# Altium project ColdBlock_PID_Main01.PrjPcb
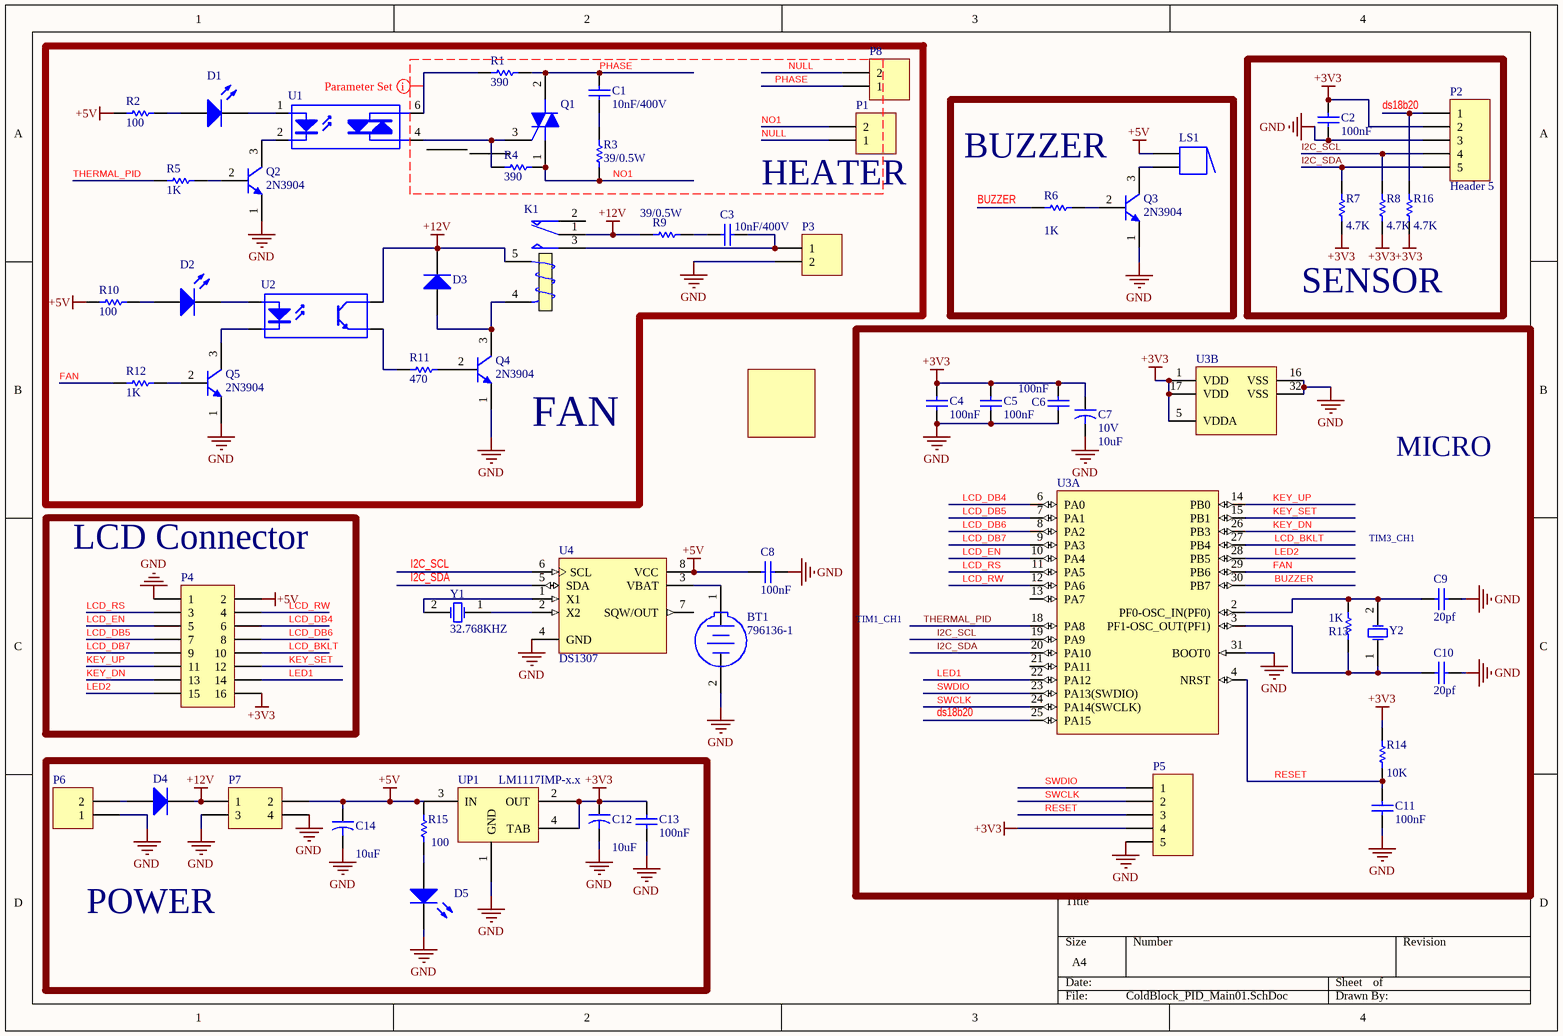
[diagram p0: ColdBlock_PID_Main01.SchDoc]
1 sheet, 59 parts. Net scope: global (net labels, ports and power ports of the same name join across sheets).
Board file: ColdBlock_PID_Main01.PcbDoc

## Sheet ColdBlock_PID_Main01.SchDoc
size A4

### Parts
*  Logo  [LOGO_PARS_TOP]  (value not drawn)
BT1  796136-1  [BTH2032_dip]
C1  10nF/400V  [Cap_polyester_400V]
C2  value 100nF  [CAP_MLCC_RAD_0.1]  (hidden comment: Cap)
C3  10nF/400V  [Cap_polyester_400V]
C4  value 100nF  [CAP_MLCC_RAD_0.1]  (hidden comment: Cap)
C5  value 100nF  [CAP_MLCC_RAD_0.1]  (hidden comment: Cap)
C6  value 100nF  [CAP_MLCC_RAD_0.1]  (hidden comment: Cap)
C7  10V  value 10uF  [Cap electrolitic radial 5x11-2]
C8  value 100nF  [CAP_MLCC_RAD_0.1]  (hidden comment: Cap)
C9  value 20pf  [CAP_MLCC_RAD_0.1]  (hidden comment: Cap)
C10  value 20pf  [CAP_MLCC_RAD_0.1]  (hidden comment: Cap)
C11  value 100nF  [CAP_MLCC_RAD_0.1]  (hidden comment: Cap)
C12  value 10uF  [Cap electrolitic radial 5x11-2]  (hidden comment: 16V)
C13  value 100nF  [CAP_MLCC_RAD_0.1]  (hidden comment: Cap)
C14  value 10uF  [Cap electrolitic radial 5x11-2]  (hidden comment: 25 V)
D1  LED1  [LED5MM_BLUE]  (value not drawn)
D2  LED1  [LED5MM_RED]  (value not drawn)
D3  Diode 1N4007  [do-204al]  (value not drawn)
D4  1N4007  [DO-204AL]  (value not drawn)
D5  LED0  [LED5MM_BLUE]  (value not drawn)
K1  Relay/12V  [Relay 18.85x15.35x15.70]  (value not drawn)
LS1  Buzzer  [BUZZER_12A05]  (value not drawn)
P1  Header 2  [KF301 2PIN]  (value not drawn)
P2  Header 5  [HDR1X5]
P3  Header 2  [KF301 2PIN]  (value not drawn)
P4  Header 8X2  [IDC2.54_16PIN]  (value not drawn)
P5  Header 5  [HDR_1x6]  (value not drawn)
P6  Header 2  [KF301 2PIN]  (value not drawn)
P7  MINI-360  [MINI360-DCDC]  (value not drawn)
P8  Header 2  [KF301 2PIN]  (value not drawn)
Q1  BT139  [TO-220 AB]  (value not drawn)
Q2  2N3904  [TO-92 STR]
Q3  2N3904  [TO-92 STR]
Q4  2N3904  [TO-92 STR]
Q5  2N3904  [TO-92 STR]
R1  value 390  [Axial 0_5W 5_0mm]  (hidden comment: Res1)
R2  value 100  [Axial 0_25 W, 0_4 IN LEAD PITCH]  (hidden comment: Res1)
R3  value 39/0.5W  [Axial 0_5W 5_0mm]  (hidden comment: Res1)
R4  value 390  [Axial 0_5W 5_0mm]  (hidden comment: Res1)
R5  value 1K  [Axial 0_25 W, 0_4 IN LEAD PITCH]  (hidden comment: Res1)
R6  value 1K  [Axial 0_25 W, 0_4 IN LEAD PITCH]  (hidden comment: Res1)
R7  value 4.7K  [Axial 0_25 W, 0_4 IN LEAD PITCH]  (hidden comment: Res1)
R8  value 4.7K  [Axial 0_25 W, 0_4 IN LEAD PITCH]  (hidden comment: Res1)
R9  value 39/0.5W  [Axial 0_5W 5_0mm]  (hidden comment: Res1)
R10  value 100  [Axial 0_25 W, 0_4 IN LEAD PITCH]  (hidden comment: Res1)
R11  value 470  [Axial 0_25 W, 0_4 IN LEAD PITCH]  (hidden comment: Res1)
R12  value 1K  [Axial 0_25 W, 0_4 IN LEAD PITCH]  (hidden comment: Res1)
R13  value 1K  [Axial 0_25 W, 0_4 IN LEAD PITCH]  (hidden comment: Res1)
R14  value 10K  [Axial 0_25 W, 0_4 IN LEAD PITCH]  (hidden comment: Res1)
R15  value 100  [Axial 0_25 W, 0_4 IN LEAD PITCH]  (hidden comment: Res1)
R16  value 4.7K  [Axial 0_25 W, 0_4 IN LEAD PITCH]  (hidden comment: Res1)
U1  MOC3063  [MOC3063]  (value not drawn)
U2  PC817  [DIP_4]  (value not drawn)
U3  STM32F030K6T6  [STM-LQFP32_N]  (value not drawn)  (parts A,B of 2)
U4  DS1307  [DIP8]
UP1  LM1117IMP-x.x  [SOT223_4]
Y1  32.768KHZ  [Crystal_NC308]
Y2  8MHz  [CRYSTAL Small]  (value not drawn)

### Blocks framed on the sheet
FAN: C1 C3 D1-D3 K1 P1 P3 P8 Q1 Q2 Q4 Q5 R1-R5 R9-R12 U1 U2
SENSOR: C2 P2 R7 R8 R16
BUZZER: LS1 Q3 R6
MICRO: C4-C7 C9-C11 P5 R13 R14 U3 Y2
LCD Connector: P4
POWER: C12-C14 D4 D5 P6 P7 R15 UP1

### Nets
+3V3: C2.2 C4.2 C5.2 C6.2 C7.1 C12.1 C13.2 P2.2 P4.16 P5.4 R7.2 R8.2 R14.1 R16.2 U3.1(VDD) U3.5(VDDA) U3.17(VDD) UP1.2(OUT) UP1.4(TAB)
+5V: C8.1 C14.1 LS1.1 P4.2 P7.2 R2.1 R10.1 R15.2 U4.8(VCC) UP1.3(IN)
+12V: D3.2(K) D4.2(K) K1.1(COM) K1.5(T1) P7.1 R9.1 U2.4(C)
GND: BT1.2(-) C2.1 C4.1 C5.1 C6.1 C7.2 C8.2 C9.1 C10.1 C11.2 C12.2 C13.1 C14.2 D5.2(K) P2.3 P3.2 P4.1 P5.5 P6.1 P7.3 P7.4 Q2.1(E) Q3.1(E) Q4.1(E) Q5.1(E) U3.16(VSS) U3.31(BOOT0) U3.32(VSS) U4.4(GND) UP1.1(GND)
BUZZER: R6.1 U3.30(PB7)
ds18b20: P2.1 R16.1 U3.25(PA15)
FAN: R12.2 U3.29(PB6)
I2C_SCL: P2.4 R8.1 U3.19(PA9) U4.6(SCL)
I2C_SDA: P2.5 R7.1 U3.20(PA10) U4.5(SDA)
KEY_DN: P4.13 U3.26(PB3)
KEY_SET: P4.12 U3.15(PB1)
KEY_UP: P4.11 U3.14(PB0)
LCD_BKLT: P4.10 U3.27(PB4)
LCD_DB4: P4.6 U3.6(PA0)
LCD_DB5: P4.7 U3.7(PA1)
LCD_DB6: P4.8 U3.8(PA2)
LCD_DB7: P4.9 U3.9(PA3)
LCD_EN: P4.5 U3.10(PA4)
LCD_RS: P4.3 U3.11(PA5)
LCD_RW: P4.4 U3.12(PA6)
LED1: P4.14 U3.22(PA12)
LED2: P4.15 U3.28(PB5)
NO1: P1.2 Q1.1(M1) R3.1 R4.1
NULL: P1.1 P8.2
PHASE: C1.1 P8.1 Q1.2(M2) R1.1
RESET: C11.1 P5.3 R14.2 U3.4(NRST)
SWCLK: P5.2 U3.24(PA14(SWCLK))
SWDIO: P5.1 U3.23(PA13(SWDIO))
THERMAL_PID: R5.1 U3.18(PA8)
NetBT1_1: BT1.1(+) U4.3(VBAT)
NetC1_2: C1.2 R3.2
NetC3_1: C3.1 K1.3(NO) P3.1
NetC3_2: C3.2 R9.2
NetC9_2: C9.2 R13.2 U3.2(PF0-OSC_IN(PF0)) Y2.2(OSC2)
NetC10_2: C10.2 R13.1 U3.3(PF1-OSC_OUT(PF1)) Y2.1(OSC1)
NetD1_1: D1.1(A) R2.2
NetD1_2: D1.2(K) U1.1(A)
NetD2_1: D2.1(A) R10.2
NetD2_2: D2.2(K) U2.1(A)
NetD3_1: D3.1(A) K1.4(T2) Q4.3(C)
NetD4_1: D4.1(A) P6.2
NetD5_1: D5.1(A) R15.1
NetLS1_2: LS1.2 Q3.3(C)
NetQ1_3: Q1.3(G) R4.2 U1.4(A/K)
NetQ2_2: Q2.2(B) R5.2
NetQ2_3: Q2.3(C) U1.2(K)
NetQ3_2: Q3.2(B) R6.2
NetQ4_2: Q4.2(B) R11.1
NetQ5_2: Q5.2(B) R12.1
NetQ5_3: Q5.3(C) U2.2(K)
NetR1_2: R1.2 U1.6(A/K)
NetR11_2: R11.2 U2.3(E)
NetU4_1: U4.1(X1) Y1.2(OSC2)
NetU4_2: U4.2(X2) Y1.1(OSC1)

Not connected (* = marked no-connect by the designer): K1 2(NC); U1 3(NC) 5(NC); U3 13(PA7) 21(PA11); U4 7(SQW/OUT)

### Layout directives
net class HV: NetR1_2

### Notes on the sheet
- (near P1) HEATER
- TIM3_CH1
- TIM1_CH1

### Library data of the parts
BT1 = 796136-1: Battery Connector, 1 Cell, CR2032, 2-Pin SMD, RoHS, Tape and Reel; Other Names: A99327 / A99327-ND / A99327CT; Battery Type, Function: Coin Cell, Holder; Style: Holder (Open); For Use With: SY189-ND / - BATT LITH COIN 3V 20MM / SY188-ND / - BATT LITH COIN 3V 20MM / SY138-ND / - BATT LITH COIN 3V 20MM / N189-ND / - BATTERY LITHIUM COIN 3 VOLT 20MM / N188-ND / - BATTERY LITHIUM COIN 3 VOLT 20MM / N138-ND / - BATTERY LITHIUM COIN 3 VOLT 20MM / N037-ND / - BATTERY LITHIUM COIN 3 VOLT 20MM / P037-ND / - BATTERY LITHIUM COIN 3V 20MM / P189-ND / - BATTERY LITHIUM COIN 3V 20MM / P188-ND / - BATTERY LITHIUM COIN 3V 20MM / More...; 3D Model: 796136-1.pdf; Dynamic Catalog: A9932 Series; Battery Series: 2032; Number of Cells: 1; Battery Cell Size: Coin, 20.0mm; PackageReference: SMD; PackageDescription: 2-Pin Surface Mount Device, Body 32.31 x 19.05 mm; Supplier 1: Farnell; Supplier Part Number 1: 2775806; Supplier 2: Digi-Key; Supplier Part Number 2: A99327TR-ND; Supplier 3: Digi-Key; Supplier Part Number 3: A99327CT-ND; Supplier 4: Digi-Key; Supplier Part Number 4: A99327DKR-ND; Standard Package: 1; Height Above Board: 0.26" (6.6mm); RoHS Information: 796136-1 Statement of Compliance; Family: Battery Holders, Clips, Contacts; Termination Style: SMD (SMT) Tab; Category: Battery Products; Mounting Type: PCB, Surface Mount; Mounting Technology: Surface Mount; ComponentLink1Description: Manufacturer URL; ComponentLink1URL: http://www.te.com; ComponentLink2Description: Datasheet; ComponentLink2URL: http://www.te.com/commerce/DocumentDelivery/DDEController?Action=srchrtrv&DocNm=796136&DocType=Customer+Drawing&DocLang=English&DocFormat=pdf&PartCntxt=796136-1
C1-C6 C8-C11 C13 = Cap: Capacitor; Published: 8-Jun-2000; LatestRevisionDate: 17-Jul-2002; LatestRevisionNote: Re-released for DXP Platform.; PackageReference: RAD-0.3; Publisher: Altium Limited; PackageDescription: Radial Cap, Thru-Hole; 2 Leads; 0.3 in Pin Spacing
  C1 C3: Value: 10nF/400V
C7 C12 C14 = Cap2: Capacitor; Published: 23-Sep-2002; PackageReference: CAPR5-4X5; Publisher: Altium Limited; PackageDescription: Capacitor; 2 Leads
D1 D2 = LED1: Typical RED GaAs LED; Published: 8-Jun-2000; LatestRevisionDate: 08-Jul-2005; LatestRevisionNote: Mech Layer 1 removed.; PackageReference: LED-1; Publisher: Altium Limited; PackageDescription: LED; 2 Leads
D3 = Diode 1N4007: 1 Amp General Purpose Rectifier; Published: 8-Jun-2000; LatestRevisionDate: 17-Jul-2002; LatestRevisionNote: Re-released for DXP Platform.; DatasheetVersion: 1998; PackageVersion: Aug-1999; PackageReference: DO-41; Publisher: Altium Limited; PackageDescription: Diode, Axial; Body 5.2 x 2.7 mm (LxDia. max), Lead Dia. 0.86 mm (max); Code_JEDEC: DO-204-AL; ComponentLink1Description: Manufacturer Link; ComponentLink1URL: http://www.fairchildsemi.com/; ComponentLink2Description: Datasheet; ComponentLink2URL: http://www.fairchildsemi.com/ds/1N%2F1N4001.pdf
D4 = Diode: Default Diode; Published: 8-Jun-2000; LatestRevisionDate: 17-Jul-2002; LatestRevisionNote: Re-released for DXP Platform.; PackageVersion: Sep-1996; PackageReference: SMC; Publisher: Altium Limited; PackageDescription: DO-214-AB/SMC; 2 C-Bend Leads; Body 7.9 x 5.9 mm, inc. leads (LxW); Code_JEDEC: DO-214-AB
D5 = LED0: Typical INFRARED GaAs LED; Published: 8-Jun-2000; LatestRevisionDate: 08-Jul-2005; LatestRevisionNote: Mech Layer 1 removed.; PackageReference: LED-0; Publisher: Altium Limited; PackageDescription: LED; 2 Leads
K1 = Relay: SPDT Relay; Published: 8-Jun-2000; LatestRevisionDate: 17-Jul-2002; LatestRevisionNote: Re-released for DXP Platform.; PackageReference: MODULE5B; Publisher: Altium Limited
LS1 = Buzzer: Magnetic Transducer Buzzer; Published: 24-Mar-1999; LatestRevisionDate: 17-Dec-2003; LatestRevisionNote: Schematic revised, PCB Footprint replaced.; DatasheetVersion: 17-Dec-2003; PackageReference: ABSM-1574; Publisher: Altium Limited; PackageDescription: Magnetic Transducer Buzzer; ComponentLink1Description: Manufacturer Link; ComponentLink1URL: http://www.megastar.com/linecard/buzzmode/index.php
P1 P3 P6 P8 = Header 2: Header, 2-Pin; LatestRevisionDate: 17-Jul-2002; LatestRevisionNote: Re-released for DXP Platform.; Publisher: Altium Limited
P2 P5 = Header 5: Header, 5-Pin; LatestRevisionDate: 17-Jul-2002; LatestRevisionNote: Re-released for DXP Platform.; Publisher: Altium Limited
P4 = Header 8X2: Header, 8-Pin, Dual row; LatestRevisionDate: 17-Jul-2002; LatestRevisionNote: Re-released for DXP Platform.; Publisher: Altium Limited
P7 = Header 2X2: Header, 2-Pin, Dual row; LatestRevisionDate: 17-Jul-2002; LatestRevisionNote: Re-released for DXP Platform.; Publisher: Altium Limited
Q1 = Triac: Silicon Bidirectional Triode Thyristor; Note: Pin 2 is electrically connected to Pin 4 (TAB); Published: 29-Sep-2000; LatestRevisionDate: 17-Jul-2002; LatestRevisionNote: Re-released for DXP Platform.; DatasheetVersion: 1999; PackageReference: 369-03; Publisher: Altium Limited; PackageDescription: TO, Thru-Hole, Vertical, Heatsink Mounted; 3 In-Line Leads; Pitch 2.28 mm; ComponentLink1Description: Manufacturer Link; ComponentLink1URL: http://www.motorola.com/
Q2-Q5 = 2N3904: NPN General Purpose Amplifier; Published: 8-Jun-2000; LatestRevisionDate: 15-Jan-2003; LatestRevisionNote: PCB Footprint 'BCY-W3/D4.7' replaced; DatasheetVersion: 1997; PackageVersion: Sep-1998; PackageReference: TO-92A; Publisher: Altium Limited; PackageDescription: TO, Flat Index; 3 In-Line, Axial Leads; Body Dia. 4.5mm; Leads 0.51 x 0.48 mm (max); ComponentLink1Description: Manufacturer Link; ComponentLink1URL: http://www.fairchildsemi.com/; ComponentLink2Description: Datasheet; ComponentLink2URL: http://www.fairchildsemi.com/ds/2N%2F2N3904.pdf
R1-R16 = Res1: Resistor; Published: 8-Jun-2000; LatestRevisionDate: 17-Jul-2002; LatestRevisionNote: Re-released for DXP Platform.; PackageReference: AXIAL-0.3; Publisher: Altium Limited; PackageDescription: Axial Device, Thru-Hole; 2 Leads; 0.3 in Pin Spacing
U1 = Opto TRIAC: Opto-Triac; Published: 24-Mar-1999; LatestRevisionDate: 17-Jul-2002; LatestRevisionNote: Re-released for DXP Platform.; PackageReference: NPSIP4A; Publisher: Altium Limited; PackageDescription: SIP; 4 Leads; Body 10 x 11.5 x 7.5 mm (typ); Pitch 2.54 mm
U2 = Optoisolator1: 4-Pin Phototransistor Optocoupler; Published: 24-Mar-1999; LatestRevisionDate: 04-Mar-2005; LatestRevisionNote: Sch pins 3 & 4 Swapped.; DatasheetVersion: Nov-2003; PackageReference: DIP-4; Publisher: Altium Limited
U3 = STM32F030K6T6: ARM Cortex-M0 32-bit MCU, 32 KB Flash, 4 KB Internal RAM, 26 I/Os, 32-pin LQFP, -40 to 85 degC, Tray; FLASH Size (Prog) (kB): 32; I/Os (High Current): 26; Internal RAM Size (kB): 4; Operating Frequency(F) (Processor speed) (MHz): 48; Supply Voltage(Vcc) min (V): 2.4; DatasheetVersion: Rev. 1; PackageVersion: Rev. 1, 07/2013; PackageReference: LQFP32; PackageDescription: 32-Pin Low Profile Quad Flat Package, 7 x 7 mm Body, 0.8 mm Pitch; Supplier 1: Digi-Key; Supplier Part Number 1: 497-14046-ND; Supplier 2: Newark; Supplier Part Number 2: 19X6194; Supplier 3: Mouser; Supplier Part Number 3: 511-STM32F030K6T6; Core: ARM Cortex-M0; Packing: Tray; Mounting Technology: Surface Mount; PartNumber: STM32F030K6T6; ComponentLink1Description: Manufacturer URL; ComponentLink1URL: http://www.st.com/web/en/home.html; ComponentLink2Description: Datasheet; ComponentLink2URL: http://www.st.com/st-web-ui/static/active/en/resource/technical/document/datasheet/DM00088500.pdf; ComponentLink3Description: Package Specification; ComponentLink3URL: http://www.st.com/st-web-ui/static/active/en/resource/technical/document/datasheet/DM00088500.pdf
U4 = DS1307: 64 X 8 Serial Real-Time Clock; Published: 13-Oct-2000; LatestRevisionDate: 17-Jul-2002; LatestRevisionNote: Re-released for DXP Platform.; DatasheetVersion: 10-Aug-1999; PackageVersion: 1999; PackageReference: DIP8; Publisher: Altium Limited; PackageDescription: DIP, 8-Pin, Row Spacing 7.62 mm, Pitch 2.54 mm; ComponentLink1Description: Manufacturer Link; ComponentLink1URL: http://www.maxim-ic.com/; ComponentLink2Description: Datasheet; ComponentLink2URL: http://pdfserv.maxim-ic.com/en/ds/DS1307.pdf; ComponentLink3Description: Discontinuation Notice; ComponentLink3URL: http://www.maxim-ic.com/qa/pdfs/non-obsolescence-letter.pdf
UP1 = LM1117IMP-x.x: x.x Volt, 800mA Low-Dropout Linear Regulator, 4-pin SOT-223; Designer: Abbas Basereh; Data: 16-12-2016; VALUE: LM1117IMP-x.x
Y1 Y2 = ECS-110-S-5P: Crystal Oscillator; Published: 17-Jul-2002; DatasheetDocument: 18-Apr-2000; PackageReference: CSM-7; Publisher: Altium Limited; ComponentLink1Description: Manufacturer Link; ComponentLink1URL: http://www.ecsxtal.com/; ComponentLink2Description: Datasheet; ComponentLink2URL: http://www.ecsxtal.com/pdf3/CSM_7.pdf